# Altium schematic sheet ff.SchDoc
size A0
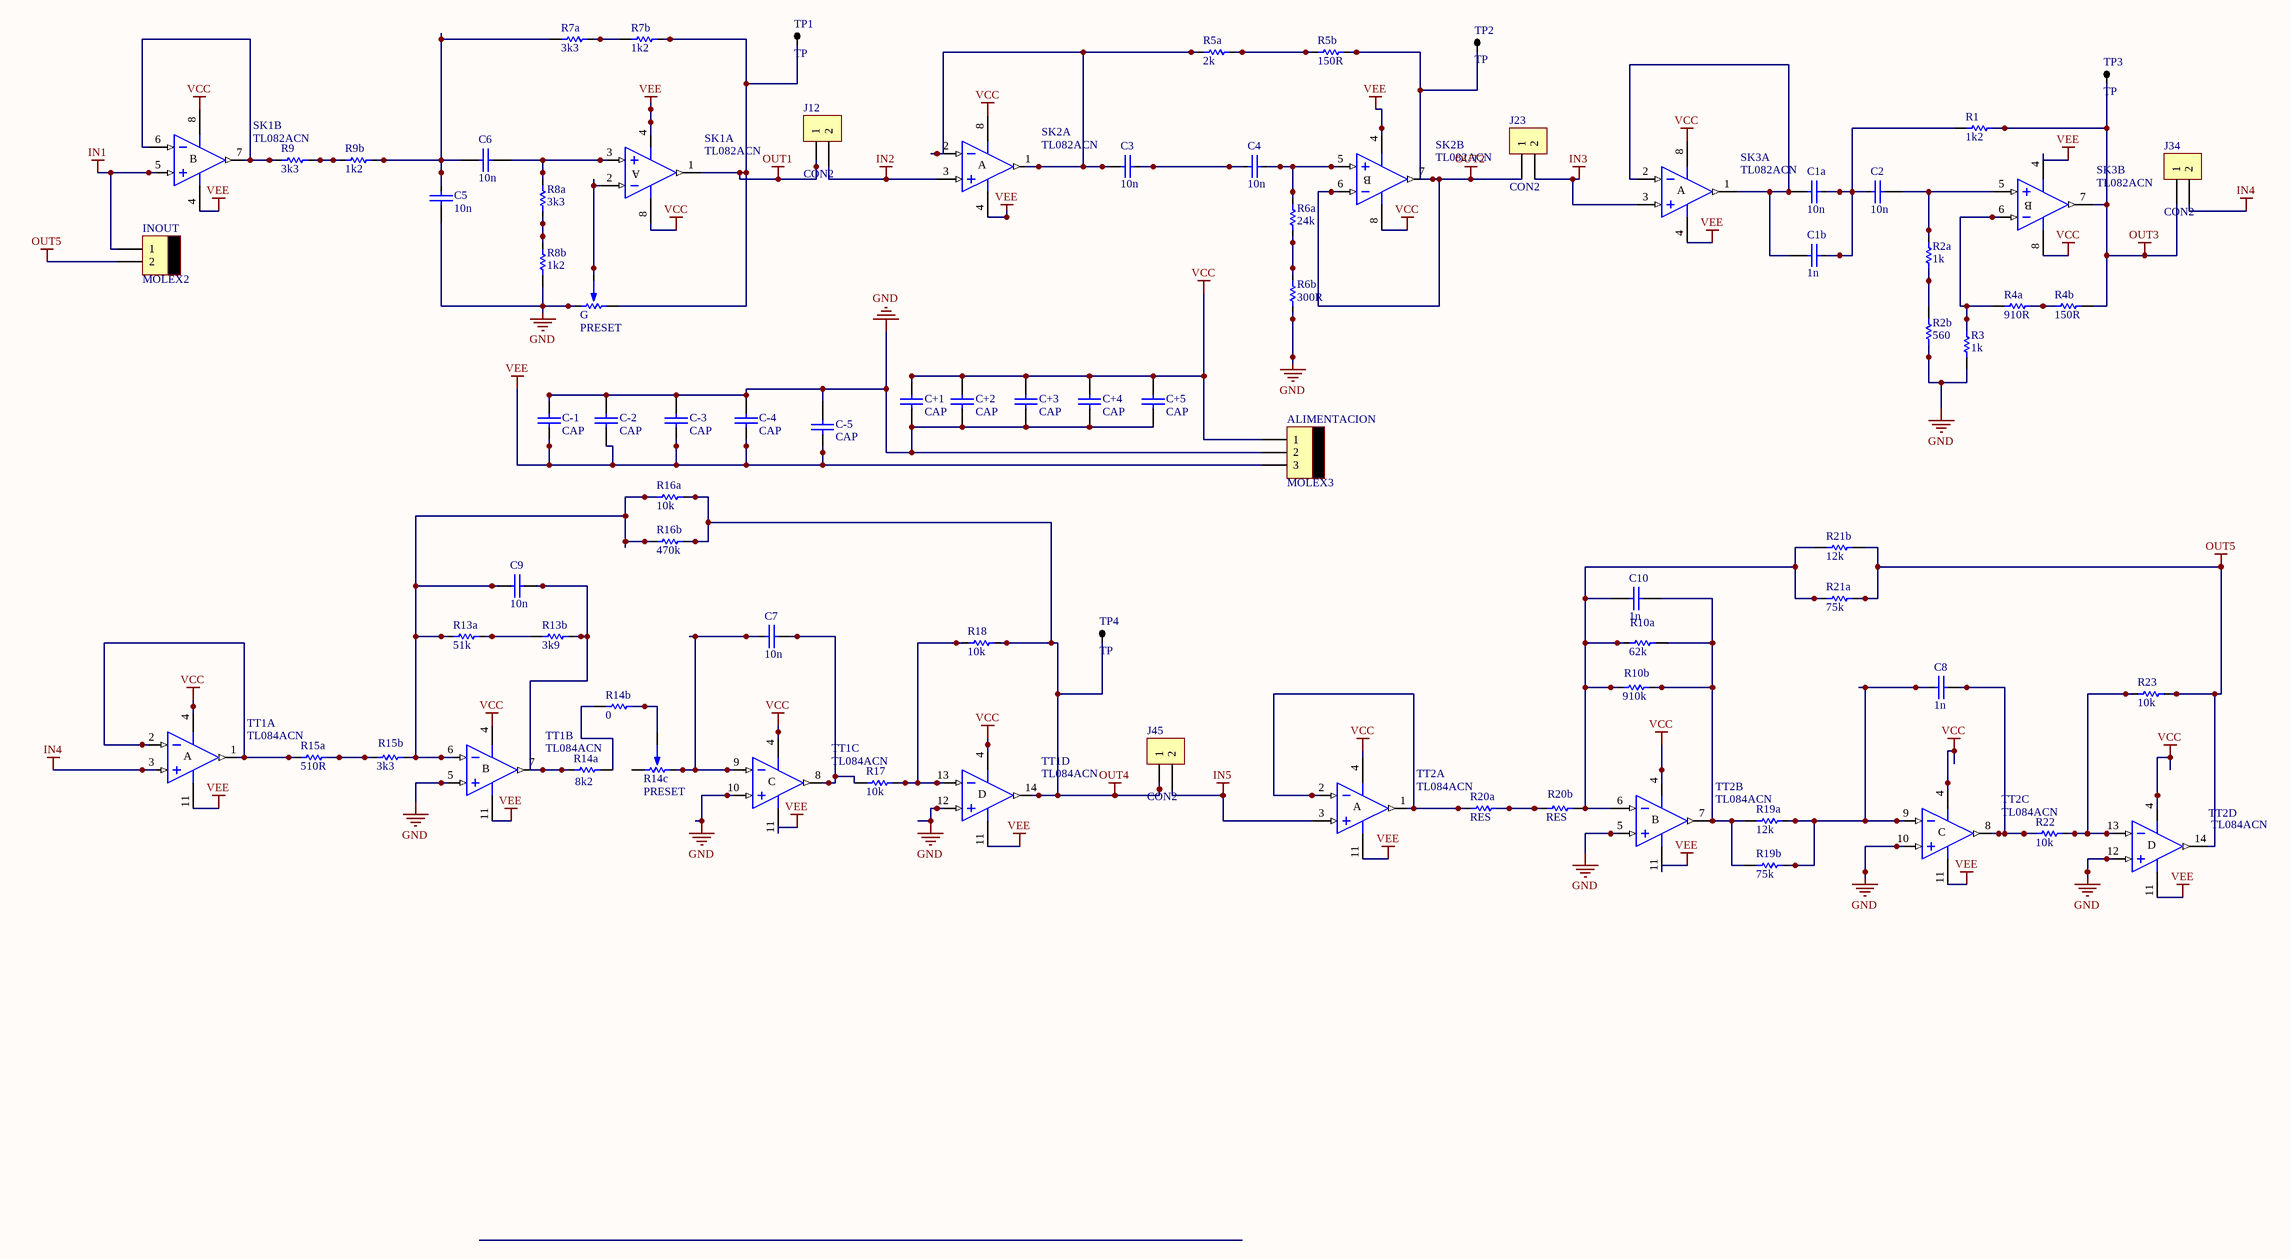
[diagram p0: ff.SchDoc]

## Parts
ALIMENTACION  MOLEX3  [MOLEX3]
C1a  10n  [CAP200]
C1b  1n  [CAP200]
C2  10n  [CAP200]
C3  10n  [CAP200]
C4  10n  [CAP200]
C5  10n  [CAP200]
C6  10n  [CAP200]
C7  10n  [CAP200]
C8  1n  [CAP200]
C9  10n  [CAP200]
C10  1n  [CAP200]
C+1  CAP  [CAP200]
C+2  CAP  [CAP200]
C+3  CAP  [CAP200]
C+4  CAP  [CAP200]
C+5  CAP  [CAP200]
C-1  CAP  [CAP200]
C-2  CAP  [CAP200]
C-3  CAP  [CAP200]
C-4  CAP  [CAP200]
C-5  CAP  [CAP200]
G  PRESET  [PRESET V]
INOUT  MOLEX2  [MOLEX2]
J12  CON2  [SIP2]
J23  CON2  [SIP2]
J34  CON2  [SIP2]
J45  CON2  [SIP2]
R1  1k2  [0805]
R2a  1k  [0805]
R2b  560  [0805]
R3  1k  [0805]
R4a  910R  [0805]
R4b  150R  [0805]
R5a  2k  [0805]
R5b  150R  [0805]
R6a  24k  [0805]
R6b  300R  [0805]
R7a  3k3  [0805]
R7b  1k2  [0805]
R8a  3k3  [0805]
R8b  1k2  [0805]
R9  3k3  [0805]
R9b  1k2  [0805]
R10a  62k  [0805]
R10b  910k  [0805]
R13a  51k  [0805]
R13b  3k9  [0805]
R14a  8k2  [0805]
R14b  0  [0805]
R14c  PRESET  [PRESET V]
R15a  510R  [0805]
R15b  3k3  [0805]
R16a  10k  [0805]
R16b  470k  [0805]
R17  10k  [0805]
R18  10k  [0805]
R19a  12k  [0805]
R19b  75k  [0805]
R20a  RES  [0805]
R20b  RES  [0805]
R21a  75k  [0805]
R21b  12k  [0805]
R22  10k  [0805]
R23  10k  [0805]
SK1  TL082ACN  [DIP8]  (parts A,B of 2)
SK2  TL082ACN  [DIP8]  (parts A,B of 2)
SK3  TL082ACN  [DIP8]  (parts A,B of 2)
TP1  TP  [TPTH]
TP2  TP  [TPTH]
TP3  TP  [TPTH]
TP4  TP  [TPTH]
TT1  TL084ACN  [DIP14]  (parts A,B,C,D of 4)
TT2  TL084ACN  [DIP14]  (parts A,B,C,D of 4)

## Nets
GND: ALIMENTACION.2 C5.1 C+1.2 C+2.2 C+3.2 C+4.2 C+5.2 C-1.1 C-2.1 C-3.1 C-4.1 C-5.1 G.1 R2b.1 R3.1 R6b.1 R8b.1 TT1.5(IN+) TT1.10(IN+) TT1.12(IN+) TT2.5(IN+) TT2.10(IN+) TT2.12(IN+)
IN1: INOUT.1 SK1.5(IN+)
IN2: J12.2 SK2.3(IN+)
IN3: J23.2 SK3.3(IN+)
IN4: J34.2 TT1.3(IN+)
IN5: J45.2 TT2.3(IN+)
OUT1: G.3 J12.1 R7b.1 SK1.1(OUT) TP1.1
OUT2: J23.1 R5b.2 SK2.6(IN-) SK2.7(OUT) TP2.1
OUT3: J34.1 R1.2 R4b.1 SK3.7(OUT) TP3.1
OUT4: J45.1 R16a.2 R16b.2 R18.2 TP4.1 TT1.14(OUT)
OUT5: INOUT.2 R21a.2 R21b.2 R23.2 TT2.14(OUT)
VCC: ALIMENTACION.1 C+1.1 C+2.1 C+3.1 C+4.1 C+5.1 SK1.8(V+) SK2.8(V+) SK3.8(V+) TT1.4(V+) TT2.4(V+)
VEE: ALIMENTACION.3 C-1.2 C-2.2 C-3.2 C-4.2 C-5.2 SK1.4(V-) SK2.4(V-) SK3.4(V-) TT1.11(V-) TT2.11(V-)
NetC1a_1: C1a.1 C1b.1 SK3.1(OUT) SK3.2(IN-)
NetC1a_2: C1a.2 C1b.2 C2.1 R1.1
NetC2_2: C2.2 R2a.2 SK3.5(IN+)
NetC3_1: C3.1 R5a.1 SK2.1(OUT) SK2.2(IN-)
NetC3_2: C3.2 C4.1
NetC4_2: C4.2 R6a.2 SK2.5(IN+)
NetC5_2: C5.2 C6.2 R7a.1 R9b.2
NetC6_1: C6.1 R8a.2 SK1.3(IN+)
NetC7_1: C7.1 R14c.3 TT1.9(IN-)
NetC7_2: C7.2 R17.1 TT1.8(OUT)
NetC8_1: C8.1 R19a.2 R19b.2 TT2.9(IN-)
NetC8_2: C8.2 R22.1 TT2.8(OUT)
NetC9_1: C9.1 R13a.1 R15b.2 R16a.1 R16b.1 TT1.6(IN-)
NetC9_2: C9.2 R13b.2 R14a.1 TT1.7(OUT)
NetC10_1: C10.1 R10a.1 R10b.1 R20b.2 R21a.1 R21b.1 TT2.6(IN-)
NetC10_2: C10.2 R10a.2 R10b.2 R19a.1 R19b.1 TT2.7(OUT)
NetG_2: G.2 SK1.2(IN-)
NetR2a_1: R2a.1 R2b.2
NetR3_2: R3.2 R4a.2 SK3.6(IN-)
NetR4a_1: R4a.1 R4b.2
NetR5a_2: R5a.2 R5b.1
NetR6a_1: R6a.1 R6b.2
NetR7a_2: R7a.2 R7b.2
NetR8a_1: R8a.1 R8b.2
NetR9_1: R9.1 R9b.1
NetR9_2: R9.2 SK1.6(IN-) SK1.7(OUT)
NetR13a_2: R13a.2 R13b.1
NetR14a_2: R14a.2 R14b.1
NetR14b_2: R14b.2 R14c.2
NetR15a_1: R15a.1 TT1.1(OUT) TT1.2(IN-)
NetR15a_2: R15a.2 R15b.1
NetR17_2: R17.2 R18.1 TT1.13(IN-)
NetR20a_1: R20a.1 TT2.1(OUT) TT2.2(IN-)
NetR20a_2: R20a.2 R20b.1
NetR22_2: R22.2 R23.1 TT2.13(IN-)

Not connected (* = marked no-connect by the designer): R14c 1

## Notes on the sheet
- Labels drawn without touching a wire or pin: VCC
- (in symbol TL082ACN, part A) A
- (in symbol TL082ACN, part B) B
- (in symbol TL084ACN, part A) A
- (in symbol TL084ACN, part B) B
- (in symbol TL084ACN, part C) C
- (in symbol TL084ACN, part D) D

## Library data of the parts
C1a C1b C2-C10 = CAP
R1 R2a R2b R3 R4a R4b R5a R5b R6a R6b R7a R7b R8a R8b R9 R9b R10a R10b R13a R13b R14a R14b R15a R15b R16a R16b R17 R18 R19a R19b R21a R21b R22 R23 = RES
SK1-SK3 = TL082ACN: General-Purpose J-FET Dual Operational Amplifier; Published: 24-Aug-2001; LatestRevisionDate: 06-Jun-2005; LatestRevisionNote: Stylized 3D Model Added.; DatasheetVersion: Jan-1999; PackageReference: DIP8; Publisher: Altium Limited; PackageDescription: DIP; 8 Leads; Row Spacing 7.62 mm; Pitch 2.54 mm; Code_JEDEC: MO-001-AN; ComponentLink1Description: Manufacturer Link; ComponentLink1URL: http://www.st.com/; ComponentLink2Description: Datasheet; ComponentLink2URL: http://www.st.com/stonline/products/literature/ds/2300/tl082.pdf
TT1 TT2 = TL084ACN: General-Purpose J-FET Quad Operational Amplifier; Published: 24-Aug-2001; LatestRevisionDate: 06-Jun-2005; LatestRevisionNote: Stylized 3D Model Added.; DatasheetVersion: Jan-1999; PackageVersion: Jan-1997; PackageReference: DIP14; Publisher: Altium Limited; PackageDescription: DIP; 14 Leads; Row Spacing 7.62 mm; Pitch 2.54 mm; ComponentLink1Description: Manufacturer Link; ComponentLink1URL: http://www.st.com/; ComponentLink2Description: Datasheet; ComponentLink2URL: http://www.st.com/stonline/products/literature/ds/2301/tl084.pdf